# Altium schematic sheet ControlePotencia.SchDoc: CONTROLADORA AIRPOPCORN
size A3; DocumentNumber: 10.00.0025; SheetNumber: 4; SheetTotal: 16
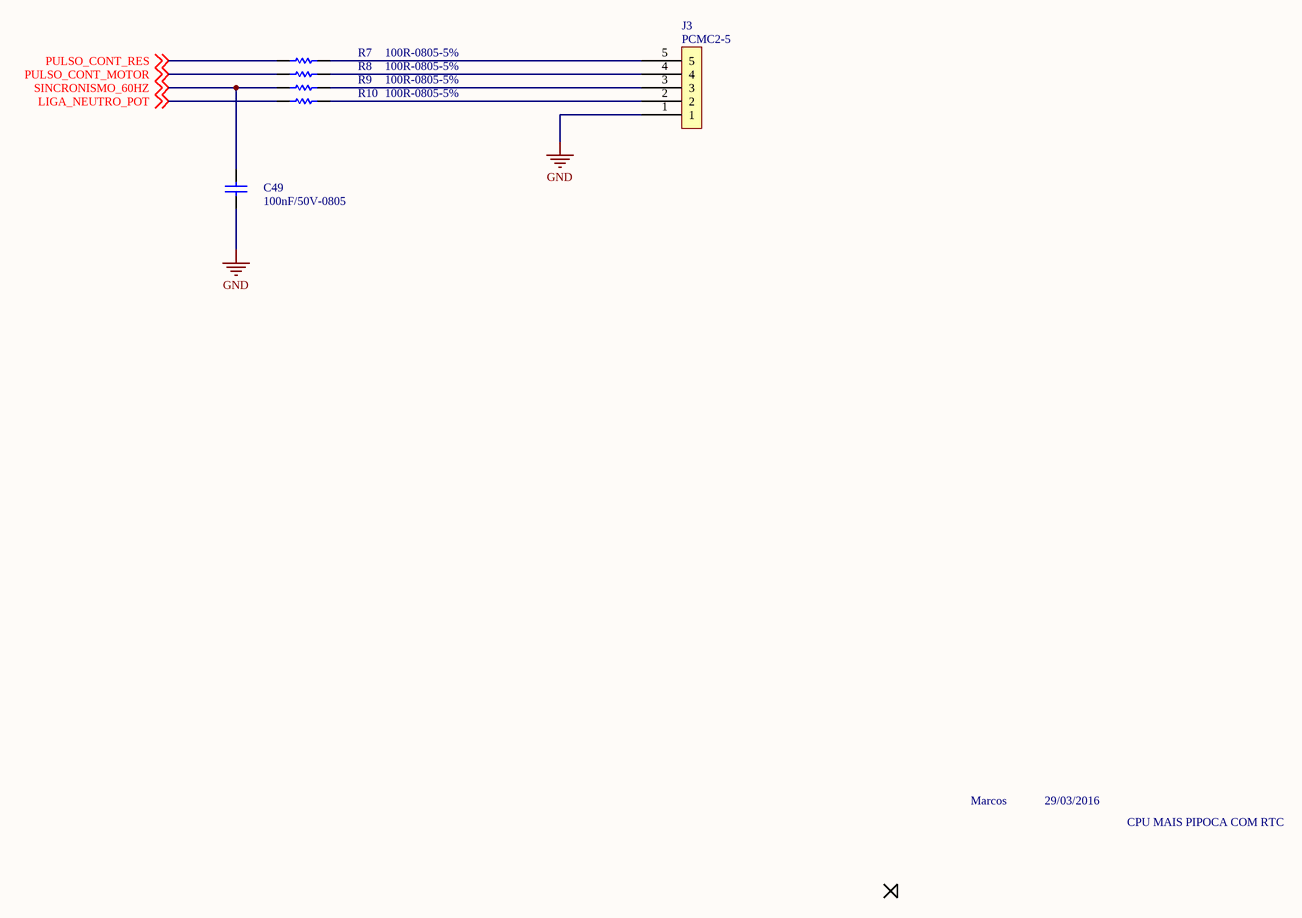
[diagram p0: ControlePotencia.SchDoc]

## Parts
C49  100nF/50V-0805
J3  PCMC2-5  [PCMC2-5]
R7  100R-0805-5%  [0805-REVISADO O]
R8  100R-0805-5%  [0805-REVISADO O]
R9  100R-0805-5%  [0805-REVISADO O]
R10  100R-0805-5%  [0805-REVISADO O]

## Nets
GND: C49.1 J3.1
LIGA_NEUTRO_POT: R10.1 ; off-sheet LIGA_NEUTRO_POT
PULSO_CONT_MOTOR: R8.1 ; off-sheet PULSO_CONT_MOTOR
PULSO_CONT_RES: R7.1 ; off-sheet PULSO_CONT_RES
SINCRONISMO_60HZ: C49.2 R9.1 ; off-sheet SINCRONISMO_60HZ
NetJ3_2: J3.2 R10.2
NetJ3_3: J3.3 R9.2
NetJ3_4: J3.4 R8.2
NetJ3_5: J3.5 R7.2

## Notes on the sheet
- Marcos
- 29/03/2016
- CPU MAIS PIPOCA COM RTC
- NOME
- DATA
- PROJETO
- DESCRIÇÃO
- www.quarktee.com.br
- desenho
- verif.
- aprov.
- TAMANHO
- CODIGO
- Todas as informações disponíveis
- não devem ser divulgadas,
- em parte ou todo.
- CIRCUITO IMPRESSO
- MONTAGEM ELETRÔNICA
- A4
- de

## Library data of the parts
C49 = 100nF/50-0805-NPO: ERP: 104.11.005
R7-R10 = 100R-0805-5%: ERP: 102.11.031